# Altium project C210 Rev_D.PrjPcb (part 4 of 5)

## Sheet C210_0001_Serial_Interface.SchDoc: C210_0001_Serial_Interface
size B; Date: 2/26/2021; CompanyName: U-blox; DrawnBy: EMOO; Engineer: EMOO; Organization: U-blox; Address1: 2601 25th St. SE; Address2: Salem, OR 97302; SheetNumber: 1; SheetTotal: 7; Website: www.u-blox.com; SheetSize: B; SheetTitle: C-210 Serial Interface
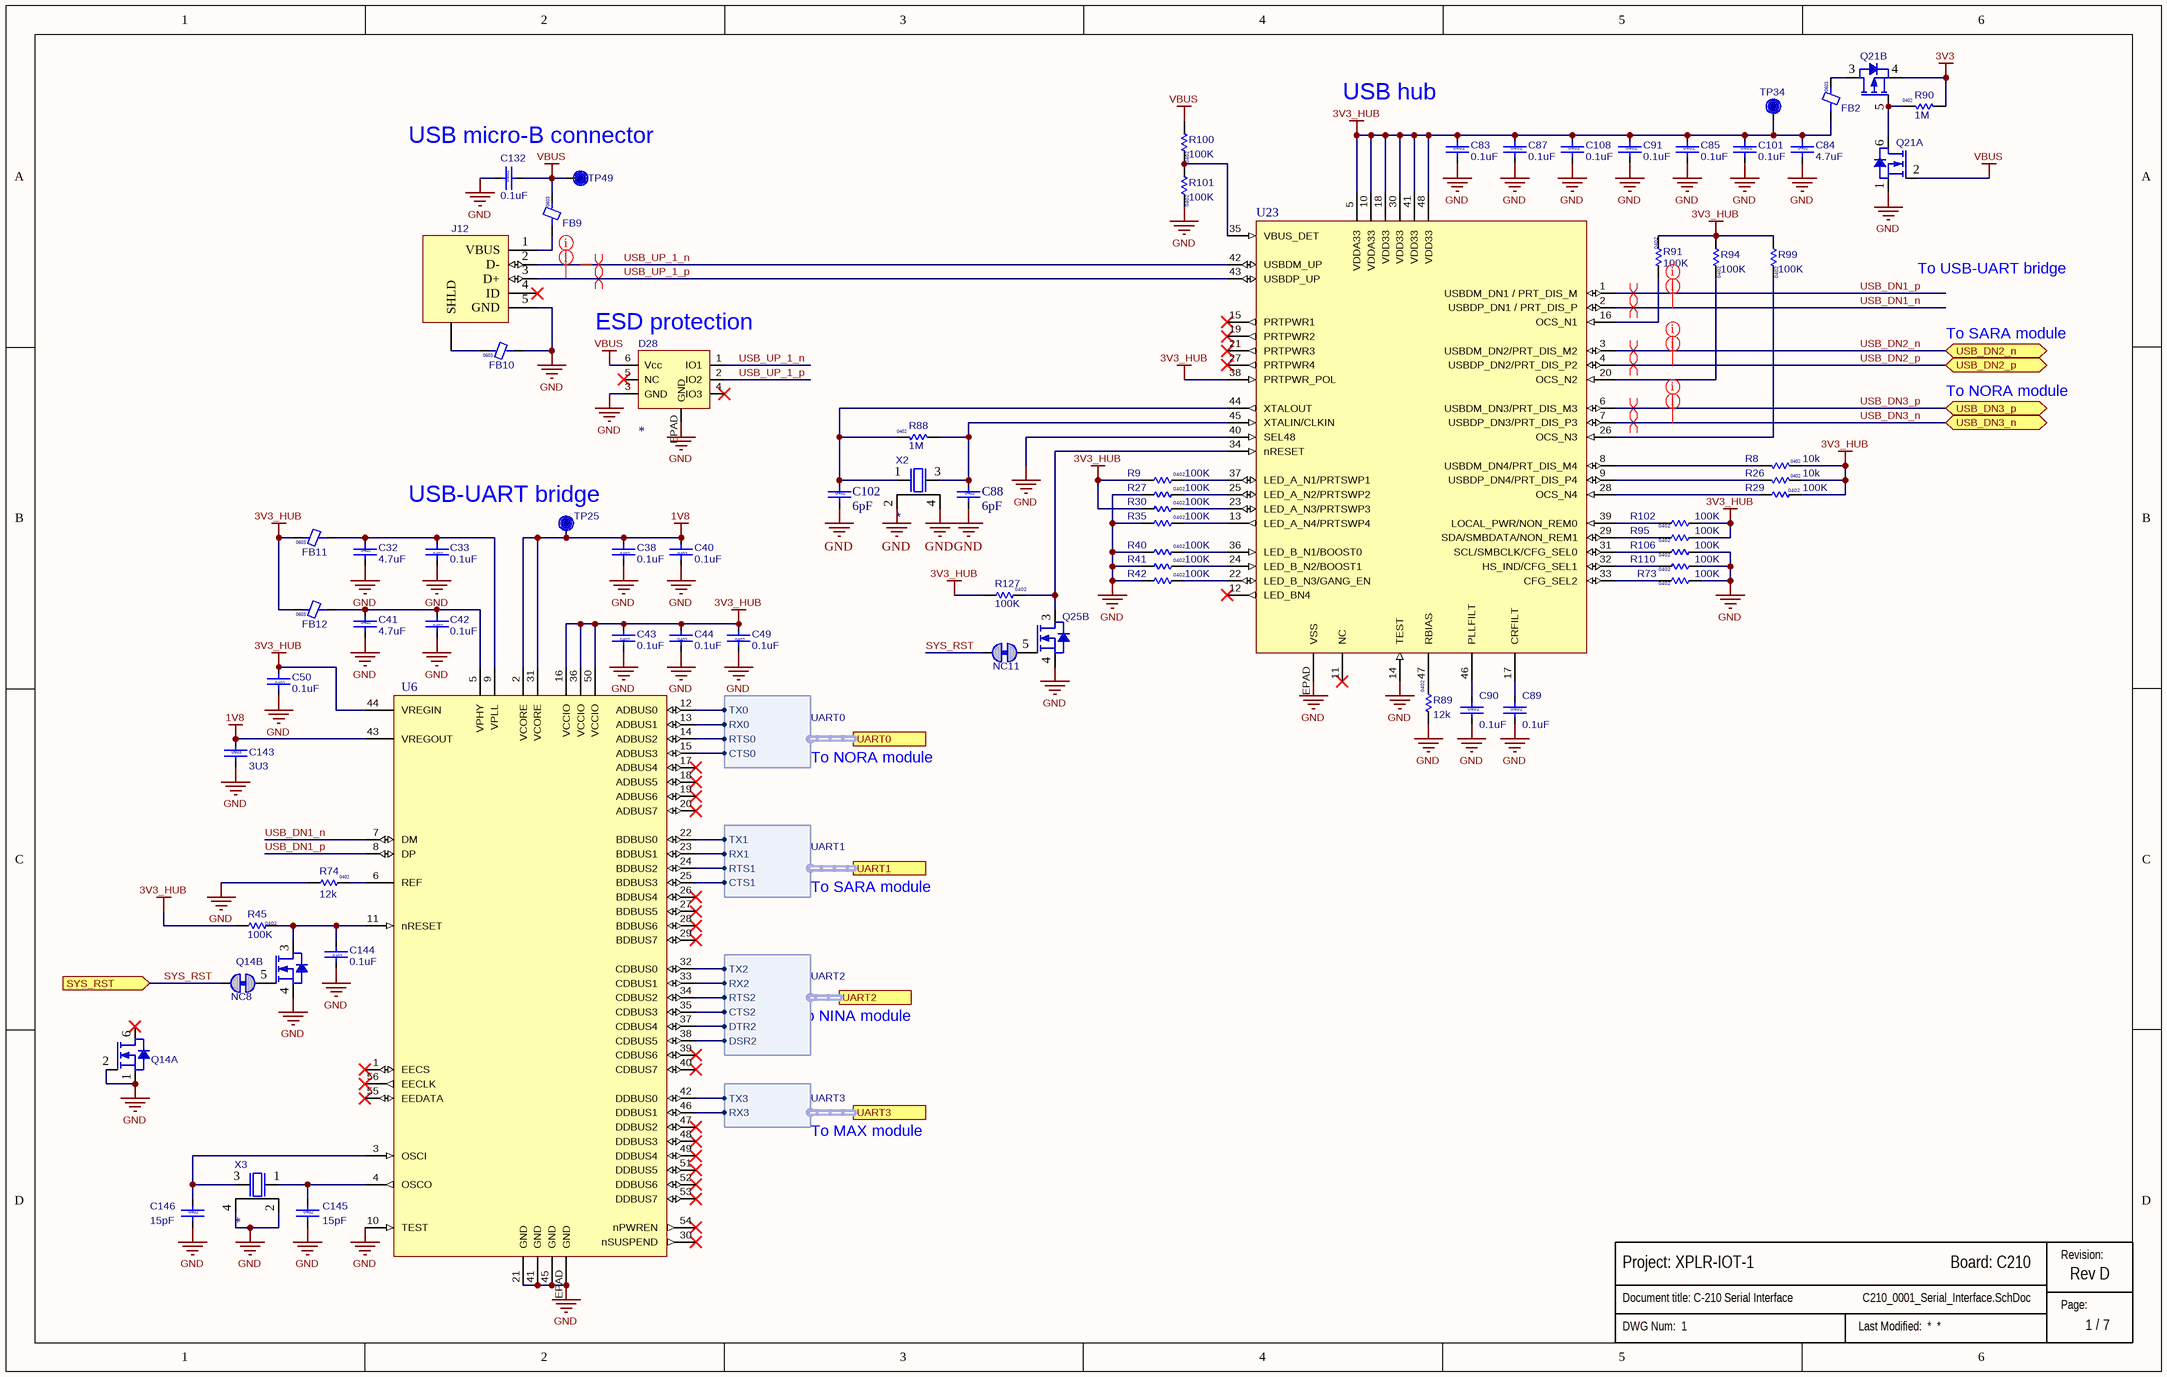
[diagram p5: C210_0001_Serial_Interface.SchDoc]

### Parts
(Parts that share a designator on the sheet are numbered #1, #2 ... from top to bottom, then left to right.)
?#7  (no value)  (graphical)
C32  value 4.7uF  Size: 0402  [Cap 0402 HD]
C33  value 0.1uF  Size: 0402  [Cap 0402 HD]  (hidden comment: 120-000160.1uF)
C38  value 0.1uF  Size: 0402  [Cap 0402 HD]  (hidden comment: 120-000160.1uF)
C40  value 0.1uF  Size: 0402  [Cap 0402 HD]  (hidden comment: 120-000160.1uF)
C41  value 4.7uF  Size: 0402  [Cap 0402 HD]
C42  value 0.1uF  Size: 0402  [Cap 0402 HD]  (hidden comment: 120-000160.1uF)
C43  value 0.1uF  Size: 0402  [Cap 0402 HD]  (hidden comment: 120-000160.1uF)
C44  value 0.1uF  Size: 0402  [Cap 0402 HD]  (hidden comment: 120-000160.1uF)
C49  value 0.1uF  Size: 0402  [Cap 0402 HD]  (hidden comment: 120-000160.1uF)
C50  value 0.1uF  Size: 0402  [Cap 0402 HD]  (hidden comment: 120-000160.1uF)
C83  value 0.1uF  Size: 0402  [Cap 0402 HD]  (hidden comment: 120-000160.1uF)
C84  value 4.7uF  Size: 0402  [Cap 0402 HD]
C85  value 0.1uF  Size: 0402  [Cap 0402 HD]  (hidden comment: 120-000160.1uF)
C87  value 0.1uF  Size: 0402  [Cap 0402 HD]  (hidden comment: 120-000160.1uF)
C88  value 6pF  Size: 0402  [Cap 0402 HD]
C89  value 0.1uF  Size: 0402  [Cap 0402 HD]  (hidden comment: 120-000160.1uF)
C90  value 0.1uF  Size: 0402  [Cap 0402 HD]  (hidden comment: 120-000160.1uF)
C91  value 0.1uF  Size: 0402  [Cap 0402 HD]  (hidden comment: 120-000160.1uF)
C101  value 0.1uF  Size: 0402  [Cap 0402 HD]  (hidden comment: 120-000160.1uF)
C102  value 6pF  Size: 0402  [Cap 0402 HD]
C108  value 0.1uF  Size: 0402  [Cap 0402 HD]  (hidden comment: 120-000160.1uF)
C132  value 0.1uF  Size: 0402  [Cap 0402 HD]  (hidden comment: 120-000160.1uF)
C143  value 3U3  Size: 0603  [Cap 0603 HD]
C144  value 0.1uF  Size: 0402  [Cap 0402 HD]  (hidden comment: 120-000160.1uF)
C145  value 15pF  Size: 0402  [Cap 0402 HD]
C146  value 15pF  Size: 0402  [Cap 0402 HD]
D28  (no value)  [TPD3E001DRSR]
FB2  Size: 0603  [BLM18EG221SN1]
FB9  Size: 0603  [BLM18EG221SN1]
FB10  Size: 0603  [BLM18EG221SN1]
FB11  Size: 0603  [BLM18EG221SN1]
FB12  Size: 0603  [BLM18EG221SN1]
J12  (no value)  [USB_Micro_RA_W-2TABS]
NC8  Solderbridge-ShortDNP  [Solderbridge-Short]  (value not drawn)  (net tie, no BOM)
NC11  Solderbridge-ShortDNP  [Solderbridge-Short]  (value not drawn)  (net tie, no BOM)
Q14  (no value)  [SOT-563]  (parts A,B of 2)
Q21  (no value)  [SOT-563]  (parts A,B of 2)
Q25  (no value)  [SOT-563]  (part B of 2)
R8  value 10k  Size: 0402  [RES 0402 HD]
R9  value 100K  Size: 0402  [RES 0402 HD]
R26  value 10k  Size: 0402  [RES 0402 HD]
R27  value 100K  Size: 0402  [RES 0402 HD]
R29  value 100K  Size: 0402  [RES 0402 HD]
R30  value 100K  Size: 0402  [RES 0402 HD]
R35  value 100K  Size: 0402  [RES 0402 HD]
R40  value 100K  Size: 0402  [RES 0402 HD]
R41  value 100K  Size: 0402  [RES 0402 HD]
R42  value 100K  Size: 0402  [RES 0402 HD]
R45  value 100K  Size: 0402  [RES 0402 HD]
R73  value 100K  Size: 0402  [RES 0402 HD]
R74  value 12k  Size: 0402  [RES 0402 HD]
R88  value 1M  Size: 0402  [RES 0402 HD]
R89  value 12k  Size: 0402  [RES 0402 HD]
R90  value 1M  Size: 0402  [RES 0402 HD]
R91  value 100K  Size: 0402  [RES 0402 HD]
R94  value 100K  Size: 0402  [RES 0402 HD]
R95  value 100K  Size: 0402  [RES 0402 HD]
R99  value 100K  Size: 0402  [RES 0402 HD]
R100  value 100K  Size: 0402  [RES 0402 HD]
R101  value 100K  Size: 0402  [RES 0402 HD]
R102  value 100K  Size: 0402  [RES 0402 HD]
R106  value 100K  Size: 0402  [RES 0402 HD]
R110  value 100K  Size: 0402  [RES 0402 HD]
R127  value 100K  Size: 0402  [RES 0402 HD]
TP25  TP  [TP12R]  (value not drawn)  (no BOM)
TP34  TP  [TP12R]  (value not drawn)  (no BOM)
TP49  TP  [TP12R]  (value not drawn)  (no BOM)
U6  (no value)  [QFN0.5P8.0x8.0-56Pin_EPAD]
U23  (no value)  [QFN0.5P7.0x7.0-48Pin_EPAD]
X2  (no value)  [XTAL_2520_HD]
X3  (no value)  [XTAL_2520]

### Ports
SYS_RST (in), UART0 (harness UART0), UART1 (harness UART1), UART2 (harness UART2), UART3 (harness UART3), USB_DN2_n (bidir), USB_DN2_p (bidir), USB_DN3_n (bidir), USB_DN3_p (bidir)

### Harnesses
UART0: TX0, RX0, RTS0, CTS0
UART1: TX1, RX1, RTS1, CTS1
UART2: TX2, RX2, RTS2, CTS2, DTR2, DSR2
UART3: TX3, RX3

### Nets
1V8: C38.2 C40.2 C143.1 TP25.1 U6.2(VCORE) U6.31(VCORE) U6.43(VREGOUT)
3V3: Q21.4(S2) R90.1
3V3_HUB: C43.2 C44.2 C49.2 C50.2 C83.1 C84.1 C85.1 C87.1 C91.1 C101.1 C108.1 FB2.1 FB11.2 FB12.2 R8.2 R9.1 R26.2 R29.2 R30.1 R45.1 R91.2 R94.1 R95.1 R99.1 R102.1 R127.1 TP34.1 U6.16(VCCIO) U6.36(VCCIO) U6.44(VREGIN) U6.50(VCCIO) U23.5(VDDA33) U23.10(VDDA33) U23.18(VDD33) U23.30(VDD33) U23.38(PRTPWR_POL) U23.41(VDD33) U23.48(VDD33)
GND: C32.2 C33.1 C38.1 C40.1 C41.2 C42.1 C43.1 C44.1 C49.1 C50.1 C83.2 C84.2 C85.2 C87.2 C88.2 C89.2 C90.2 C91.2 C101.2 C102.2 C108.2 C132.1 C143.2 C144.1 C145.2 C146.2 D28.3(GND) D28.EPAD(GND) FB10.1 J12.5(GND) Q14.1(S1) Q14.2(G1) Q14.4(S2) Q21.1(S1) Q25.4(S2) R27.1 R35.1 R40.1 R41.1 R42.1 R73.2 R74.1 R89.1 R101.2 R106.2 R110.2 U6.10(TEST) U6.21(GND) U6.41(GND) U6.45(GND) U6.EPAD(GND) U23.14(TEST) U23.40(SEL48) U23.EPAD(VSS) X2.2 X2.4 X3.2 X3.4
VBUS: C132.2 D28.6(Vcc) FB9.2 Q21.2(G1) R100.1 TP49.1
DSR2: U6.38(CDBUS5) ; port UART2.DSR2
DTR2: U6.37(CDBUS4) ; port UART2.DTR2
RX1/SARA_PRI_TX: U6.23(BDBUS1) ; port UART1.RX1
SYS_RST: NC8.2 NC11.2 ; port SYS_RST
TX1/SARA_PRI_RX: U6.22(BDBUS0) ; port UART1.TX1
USB_DN1_n: U6.7(DM) U23.2(USBDP_DN1_/_PRT_DIS_P)
USB_DN1_p: U6.8(DP) U23.1(USBDM_DN1_/_PRT_DIS_M)
USB_DN2_n: U23.3(USBDM_DN2/PRT_DIS_M2) ; port USB_DN2_n
USB_DN2_p: U23.4(USBDP_DN2/PRT_DIS_P2) ; port USB_DN2_p
USB_DN3_n: U23.7(USBDP_DN3/PRT_DIS_P3) ; port USB_DN3_n
USB_DN3_p: U23.6(USBDM_DN3/PRT_DIS_M3) ; port USB_DN3_p
USB_UP_1_n: D28.1(IO1) J12.2(D-) U23.42(USBDM_UP)
USB_UP_1_p: D28.2(IO2) J12.3(D+) U23.43(USBDP_UP)
NetC32_1: C32.1 C33.2 FB11.1 U6.9(VPLL)
NetC41_1: C41.1 C42.2 FB12.1 U6.5(VPHY)
NetC88_1: C88.1 R88.1 U23.45(XTALIN/CLKIN) X2.3
NetC89_1: C89.1 U23.17(CRFILT)
NetC90_1: C90.1 U23.46(PLLFILT)
NetC102_1: C102.1 R88.2 U23.44(XTALOUT) X2.1
NetC144_2: C144.2 Q14.3(D2) R45.2 U6.11(nRESET)
NetC145_1: C145.1 U6.4(OSCO) X3.1
NetC146_1: C146.1 U6.3(OSCI) X3.3
NetFB2_2: FB2.2 Q21.3(D2)
NetFB9_1: FB9.1 J12.1(VBUS)
NetFB10_2: FB10.2 J12.6(SHLD)
NetNC8_1: NC8.1 Q14.5(G2)
NetNC11_1: NC11.1 Q25.5(G2)
NetQ21_5: Q21.5(G2) Q21.6(D1) R90.2
NetQ25_3: Q25.3(D2) R127.2 U23.34(nRESET)
NetR8_1: R8.1 U23.8(USBDM_DN4/PRT_DIS_M4)
NetR9_2: R9.2 U23.37(LED_A_N1/PRTSWP1)
NetR26_1: R26.1 U23.9(USBDP_DN4/PRT_DIS_P4)
NetR27_2: R27.2 U23.25(LED_A_N2/PRTSWP2)
NetR29_1: R29.1 U23.28(OCS_N4)
NetR30_2: R30.2 U23.23(LED_A_N3/PRTSWP3)
NetR35_2: R35.2 U23.13(LED_A_N4/PRTSWP4)
NetR40_2: R40.2 U23.36(LED_B_N1/BOOST0)
NetR41_2: R41.2 U23.24(LED_B_N2/BOOST1)
NetR42_2: R42.2 U23.22(LED_B_N3/GANG_EN)
NetR69_2: U6.46(DDBUS1) ; port UART3.RX3
NetR73_1: R73.1 U23.33(CFG_SEL2)
NetR74_2: R74.2 U6.6(REF)
NetR89_2: R89.2 U23.47(RBIAS)
NetR91_1: R91.1 U23.16(OCS_N1)
NetR94_2: R94.2 U23.20(OCS_N2)
NetR95_2: R95.2 U23.29(SDA/SMBDATA/NON_REM1)
NetR99_2: R99.2 U23.26(OCS_N3)
NetR100_2: R100.2 R101.1 U23.35(VBUS_DET)
NetR102_2: R102.2 U23.39(LOCAL_PWR/NON_REM0)
NetR106_1: R106.1 U23.31(SCL/SMBCLK/CFG_SEL0)
NetR110_1: R110.1 U23.32(HS_IND/CFG_SEL1)
NetTP20_1: U6.25(BDBUS3) ; port UART1.CTS1
NetTP21_1: U6.24(BDBUS2) ; port UART1.RTS1
NetU6_12: U6.12(ADBUS0) ; port UART0.TX0
NetU6_13: U6.13(ADBUS1) ; port UART0.RX0
NetU6_14: U6.14(ADBUS2) ; port UART0.RTS0
NetU6_15: U6.15(ADBUS3) ; port UART0.CTS0
NetU6_32: U6.32(CDBUS0) ; port UART2.TX2
NetU6_33: U6.33(CDBUS1) ; port UART2.RX2
NetU6_34: U6.34(CDBUS2) ; port UART2.RTS2
NetU6_35: U6.35(CDBUS3) ; port UART2.CTS2
NetU6_42: U6.42(DDBUS0) ; port UART3.TX3

Not connected (* = marked no-connect by the designer): D28 4(IO3)* 5(NC)*; J12 4(ID)*; Q14 6(D1)*; U6 1(EECS)* 17(ADBUS4)* 18(ADBUS5)* 19(ADBUS6)* 20(ADBUS7)* 26(BDBUS4)* 27(BDBUS5)* 28(BDBUS6)* 29(BDBUS7)* 30(nSUSPEND)* 39(CDBUS6)* 40(CDBUS7)* 47(DDBUS2)* 48(DDBUS3)* 49(DDBUS4)* 51(DDBUS5)* 52(DDBUS6)* 53(DDBUS7)* 54(nPWREN)* 55(EEDATA)* 56(EECLK)*; U23 11(NC)* 12(LED_BN4)* 15(PRTPWR1)* 19(PRTPWR2)* 21(PRTPWR3)* 27(PRTPWR4)*

### Layout directives
differential pair; net class USB_DIFF: USB_DN1_n, USB_DN1_p, USB_DN2_n, USB_DN2_p, USB_DN3_n, USB_DN3_p, USB_UP_1_n, USB_UP_1_p
net class USB: USB_DN1_n, USB_DN1_p, USB_DN2_n, USB_DN2_p, USB_DN3_n, USB_DN3_p, USB_UP_1_n, USB_UP_1_p

### Notes on the sheet
- (near C83) USB hub
- USB micro-B connector
- To USB-UART bridge
- (near D28) ESD protection
- To NORA module
- To SARA module
- (near TP25) USB-UART bridge
- To NINA module
- To MAX module
- Revision:
- Page:

### Library data of the parts
?#7 = Sub_Title_Block: as ?#5 on sheet C210_0006_Power
C32 C41 C84 = 120-00020: as C47 on sheet C210_0006_Power; Part Number: 120-00020; Supplier 1: Digi-Key; Supplier Part Number 1: 1276-1482-1-ND; Manufacturer 2: Yageo; Manufacturer Part Number 2: CC0402KRX5R6BB475; Supplier 2: Digi-Key; Supplier Part Number 2: 311-3477-1-ND; Height: 0.55mm; Max Operating Temp: 85; Min Operating Temp: -55; Pins: 2; Revision: 0C; Temperature Coefficient: X5R; Voltage: 10V
C33 C38 C40 C42-C44 C49 C50 C83 C85 C87 C89-C91 C101 C108 C132 C144 = 120-00016: as C45 on sheet C210_0006_Power; Part Number: 120-00016; Revision: 0A; Supplier 1: Digi-Key; Supplier Part Number 1: 490-6297-1-ND; Manufacturer 2: Yageo; Manufacturer P/N 2: CC0402KRX5R6BB104; Supplier 2: Digi-Key; Supplier Part Number 2: 311-1336-1-ND; Arena Link: https://app.bom.com/a/GYHPV2L2L43KRMBK?v=spec.summary; Height: 0.55mm; Pins: 2; Temperature Coefficient: X5R; Voltage: 10V
C88 C102 = 120-00048: Cap, Ceramic 6pF 50V NP0 0402  Tolerance = +/-0.5pF; Manufacturer 1: Cal-Chip Electronics; Manufacturer Part Number 1: GMC04CG6R0D50NT; Part Name: CAP CER 6pF 50V +/-0.5pF NP0 0402; Item Phase: In Production; Tolerance: Other; Use in new designs: Yes; UBX Code: None; Part Number: 120-00048; Supplier 1: None; Supplier Part Number 1: None; Manufacturer 2: Darfon Electronics Corp; Manufacturer Part Number 2: C1005NPO609DGTS; Supplier 2: None; Supplier Part Number 2: None; Height: 0.55mm; Max Operating Temp: 125; Min Operating Temp: -55; Pins: 2; Revision: 0B; Temperature Coefficient: NP0; Voltage: 50V
C143 = UBXH01-0000035: CAP CER X5R 0603 3U3 10% 10V; Manufacturer: Murata Manufacturing Company, Ltd.; Manufacturer P/N: GRM188R61A335KE15; Editor: dario.antonaz; Released by: karel.cotic; Env: ROHS; Permitted Use: Volume Products; Perferred: PREF; Mfg P/N Status: NRND; Mfg P/N Split: 100; Mfg P/N Released: Yes; Part Number: UBXH01-0000035; Tolerance: 10%; Max Voltage: 10V; Part Type: Capacitor; Release Data: 2011-07-12T16:43:12; UBX Wiki: https://wiki.u-blox.com/bin/view/Operations/PartDetails?index=15220; RefDes: C; Mfg P/N Datasheet: https://wiki.u-blox.com/bin/view/Generic/Docs/DocumentSummary?index=15218; Manufacturer 2: Samsung Electro-Mechanics; Manufacturer P/N 2: CL10A335KP8NNN; Mfg P/N Status 2: Active; Mfg P/N Split 2: 0; Mfg P/N Released 2: Yes; Mfg P/N Datasheet 2: https://wiki.u-blox.com/bin/view/Generic/Docs/DocumentSummary?index=28127
C145 C146 = 120-00110: Capacitor, Ceramic, 15pF 5%, 50V, NPO, 0402; Manufacturer 1: Murata Electronics North America; Manufacturer Part Number 1: GRM1555C1H150JA01D; Part Name: CAP CER 15pF 50V 5% NP0 0402; Item Phase: In Production; Temperature Coefficient: NP0; Tolerance: +/- 5%; Use in new designs: Yes; UBX Code: None; Part Number: 120-00110; Supplier 1: Digi-Key; Supplier Part Number 1: 490-5888-1-ND; Manufacturer 2: None; Manufacturer Part Number 2: None; Supplier 2: None; Supplier Part Number 2: None; Height: 0.55mm; Max Operating Temp: 125; Min Operating Temp: -55; Pins: 2; Revision: 0A; Voltage: 50V
D28 = TPD3E001: as D20 on sheet C210_0007_Sensors; Manufacturer Part Number 1: TPD3E001DRSR; Manufacturer 2: None; Manufacturer Part Number 2: None; Supplier 2: None; Supplier Part Number 2: None; Body Size: 3mm x 3mm; Height: 0.80mm; Max Operating Temp: 85; Min Operating Temp: -40; Pins: 6; Revision: 0A; UBX Code: None; Manufacturer P/N: *
FB2 FB9-FB12 = BLM18EG221SN1: Ferrite Bead, 220ohm @ 100MHz, 2A, 0603; Manufacturer 1: Murata Electronics North America; Manufacturer Part Number 1: BLM18EG221SN1D; Part Name: Ferrite Bead 220ohm 2A 0503; Body Size: None; Item Phase: Unreleased; Use in new designs: Yes; Value: None; Part Number: BLM18EG221SN1; Supplier 1: Digi-Key; Supplier Part Number 1: 490-3992-2-ND; Current: 2A; Height: 0.8mm; MFG Package: None; Max Operating Temp: 85; Min Operating Temp: -55; Pins: None; Revision: None; Voltage: None; Manufacturer 2: None; Manufacturer Part Number 2: None; Supplier 2: None; Supplier Part Number 2: None; UBX Code: None
J12 = 130-00008: USB Micro B Receptacle, Right Angle SMT with 2 TH Tabs, 0.65mm; Part Name: CON USB Micro-B SMT RA 2 Tabs; Part_Type: Connector; Manufacturer: FCI; Manufacturer P/N: 10118193-0001LF; Item_Phase: Production; Keyed: Yes; Locking: No; Rows: 1; Part Number: 130-00008; Revision: 0B; Supplier 1: Digi-Key; Supplier Part Number 1: 609-4616-1-ND; Manufacturer 2: Seeed Technology; Manufacturer P/N 2: Rigado 130-00008; Supplier 2: Seeed Technology; Supplier Part Number 2: Rigado 130-00008; Arena Link: https://app.bom.com/a/O6PX3ATATCBTBM9U?v=spec.summary; Color: Silver; Component Mounting Type: SMT; Connector Type: USB; Height: 3.10mm; Length: 5.05mm; Pin Pitch: 0.65mm; Pins: 5; Use in new designs: Yes; Width: 7.86mm
NC8 NC11 = Solderbridge-Short: Added By: Paul B; Part Number: Solderbridge-Short; Height: 0; DNP: DNP; Added Date: 12/2/2015
Q14 Q25 = 140-00016: MOSFET 2N-CH 20V 0.8A, SOT-563; Manufacturer 1: Toshiba Semiconductor and Storage; Manufacturer Part Number 1: SSM6N56FE,LM; Part Name: MOSFET 2N-CH 20V 0.8A SOT-563; Body Size: 1.6mm x 1.2mm; Current: 800mA; Item Phase: In Production; Transistor Type: N-Channel; Thermal Pad: No; Use in new designs: Yes; UBX Code: None; Part Number: 140-00016; Supplier 1: Digi-Key; Supplier Part Number 1: SSM6N56FELMCT-ND; Height: 0.6mm; MFG Package: SOT-563; Max Operating Temp: 150; Min Operating Temp: -55; Pins: 6; Revision: 0A; Voltage: 20V; Manufacturer 2: None; Manufacturer Part Number 2: None; Supplier 2: None; Supplier Part Number 2: None
Q21 = 140-00030: MOSFET N/P-CH 20V SOT-563, 540 mA, −430 mA; Manufacturer 1: ON Semiconductor; Manufacturer Part Number 1: NTZD3155CT2G; Body Size: 1.6mmx1.6mm; Item Phase: In Production; Transistor Type: Multiple; Thermal Pad: No; Use in new designs: Yes; UBX Code: None; Part Number: 140-00030; Supplier 1: Digi-Key; Supplier Part Number 1: NTZD3155CT2GOSCT-ND; Current: 540 mA, −430 mA; Height: 0.6mm; MFG Package: SOT-563; Max Operating Temp: 150; Min Operating Temp: -55; Part Name: MOSFET N/P-CH 20V SOT-563; Pins: 6; Revision: 0A; Voltage: 20V; Manufacturer 2: None; Manufacturer Part Number 2: None; Supplier 2: None; Supplier Part Number 2: None
R8 R26 = 180-00024: as R36 on sheet C210_0006_Power; Part Number: 180-00024; Supplier 1: Digi-Key; Supplier Part Number 1: 1276-3431-1-ND; Manufacturer 2: Hong Kong Resistors Manufactory; Manufacturer Part Number 2: RCT0210KFLF; Supplier 2: None; Supplier Part Number 2: None; Height: 0.4mm; Max Operating Temp: 155; Min Operating Temp: -55; Pins: 2; Power: 1/16W; Revision: 0E; Voltage: N/A
R9 R27 R29 R30 R35 R40-R42 R45 R73 R91 R94 R95 R99-R102 R106 R110 R127 = 180-00093: as R50 on sheet C210_0006_Power; Part Number: 180-00093; Supplier 1: Digi-Key; Supplier Part Number 1: 311-100KLRCT-ND; Manufacturer 2: Rohm Semiconductor; Manufacturer Part Number 2: MCR01MRTF1003; Supplier 2: Digi-Key; Supplier Part Number 2: RHM100KCDCT-ND; Height: 0.4mm; Max Operating Temp: 155; Min Operating Temp: -55; Pins: 2; Power: 1/16W; Revision: 0B; UBX Code: None
R74 R89 = 180-00096: Resistor 12k ohm 1% 1/16W 0402; Manufacturer 1: None; Part Name: RES SMD 12K OHM 1% 1/16W 0402; Item Phase: In Production; Tolerance: +/- 1%; Use in new designs: Yes; Part Number: 180-00096; Manufacturer Part Number 1: None; Supplier 1: Digi-Key; Supplier Part Number 1: 1276-4122-1-ND; Manufacturer 2: Yageo; Manufacturer Part Number 2: RC0402FR-0712KL; Supplier 2: Digi-Key; Supplier Part Number 2: 311-12.0KLRCT-ND; Height: 0.4mm; Max Operating Temp: 155; Min Operating Temp: -55; Pins: 2; Power: 1/16W; Revision: 0A; Voltage: None; UBX Code: None
R88 R90 = 180-00054: as R43 on sheet C210_0006_Power; Part Number: 180-00054; Supplier 1: Digi-Key; Supplier Part Number 1: 1276-3433-1-ND; Manufacturer 2: Hong Kong Resistors Manufactory; Manufacturer Part Number 2: RCT021MFLF; Supplier 2: None; Supplier Part Number 2: None; Height: 0.4mm; Max Operating Temp: 155; Min Operating Temp: -55; Pins: 2; Power: 1/16W; Revision: 0D; UBX Code: None
TP25 TP34 TP49 = TP_R: as TP28-TP31 on sheet C210_0006_Power; Size: 1.0mm; Height: 0; DNP: DNP; Added Date: 2/1/2015; Checked By: Paul B; Checked Date: 2/5/2015
U6 = FT4232H: IC, SMT, UART/SERIAL BRIDGE, QUAD, USB 2.0, FULL HANDSHAKE, 12MBps, 2.97-3.63V, 8mmx8mm QFN56; Manufacturer 1: FTDI; Body Size: 8.0mm x 8.0mm; Item Phase: Unreleased; MFG Package: QFN-56; SMT Pitch: 0.5mm; Use in new designs: Yes; UBX Code: None; Manufacturer Part Number 1: FT4232H; Height: 0.9mm; Max Operating Temp: 85; Min Operating Temp: -40; Pins: 56; Revision: None; Size: Other; Voltage: 2.97-3.63V; Manufacturer 2: None; Manufacturer Part Number 2: None; Supplier 2: None; Supplier Part Number 2: None
U23 = USB2514-HZH: 4-PORT USB 2.0 HUB CTRLR, QFN-48, 7.0mmx7.0mm; Manufacturer 1: SMSC; Current: None; Item Phase: In Production; Use in new designs: Yes; Part Number: USB2514-HZH; Manufacturer Part Number 1: USB2514-HZH; Body Size: 7.0mm x 7.0mm; Height: 1.0mm; MFG Package: QFN-48; Max Operating Temp: 70; Min Operating Temp: 0; Part Name: USB2514-HZH; Pins: 48; Revision: 0A; Voltage: N/A; UBX Code: None
X2 = 100-00017: Crystal, 24.0000MHz, 20ppm, 10pF, 100 Ohm, -20Â°C - 70Â°C, SMT 4 Pin 2520; Manufacturer 1: Abracon LLC; Manufacturer Part Number 1: ABM10-24.000MHZ-E20-T; Part Name: XTAL 24MHz 10pF 20ppm 2520; Body Size: 2.5mm x 2.0mm; Item Phase: Unreleased; MFG Package: 2520; Use in new designs: Yes; Voltage: None; Value: *; Part Number: 100-00017; Supplier 1: Digi-Key; Supplier Part Number 1: 535-9093-1-ND; Manufacturer 2: Raltron Electronics; Manufacturer Part Number 2: R2520-24.000-10-1010-TR-NS4; Supplier 2: None; Supplier Part Number 2: None; Height: 0.7mm; Max Operating Temp: 70; Min Operating Temp: -20; Pins: 4; Revision: None; UBX Code: None
X3 = 100-00033: 12MHz ±10ppm Crystal 8pF 125 Ohm -40°C ~ 85°C Surface Mount 4-SMD, No Lead; Manufacturer 1: Abracon LLC; Manufacturer Part Number 1: ABM10-167-12.000MHZ-T3; Part Name: XTAL 12MHz, 8pF, 30ppm; Body Size: 2.5mm X 2.0mm; Item Phase: Unreleased; Use in new designs: Yes; Voltage: None; Value: *; Part Number: 100-00033; Supplier 1: Digi-Key; Supplier Part Number 1: 535-13521-1-ND; Manufacturer 2: None; Manufacturer Part Number 2: None; Supplier 2: None; Supplier Part Number 2: None; Height: 0.7mm; MFG Package: 4-SMD; Max Operating Temp: 85; Min Operating Temp: -40; Pins: 4; Revision: None; UBX Code: None

## Sheet C210_0004_MAX_Module.SchDoc: C210_0004_MAX_Module
size B; Date: 2/26/2021; CompanyName: U-blox; DrawnBy: EMOO; Engineer: EMOO; Organization: U-blox; Address1: 2601 25th St. SE; Address2: Salem, OR 97302; SheetNumber: 4; SheetTotal: 7; Website: www.u-blox.com; SheetSize: B; SheetTitle: C-210 MAX Module
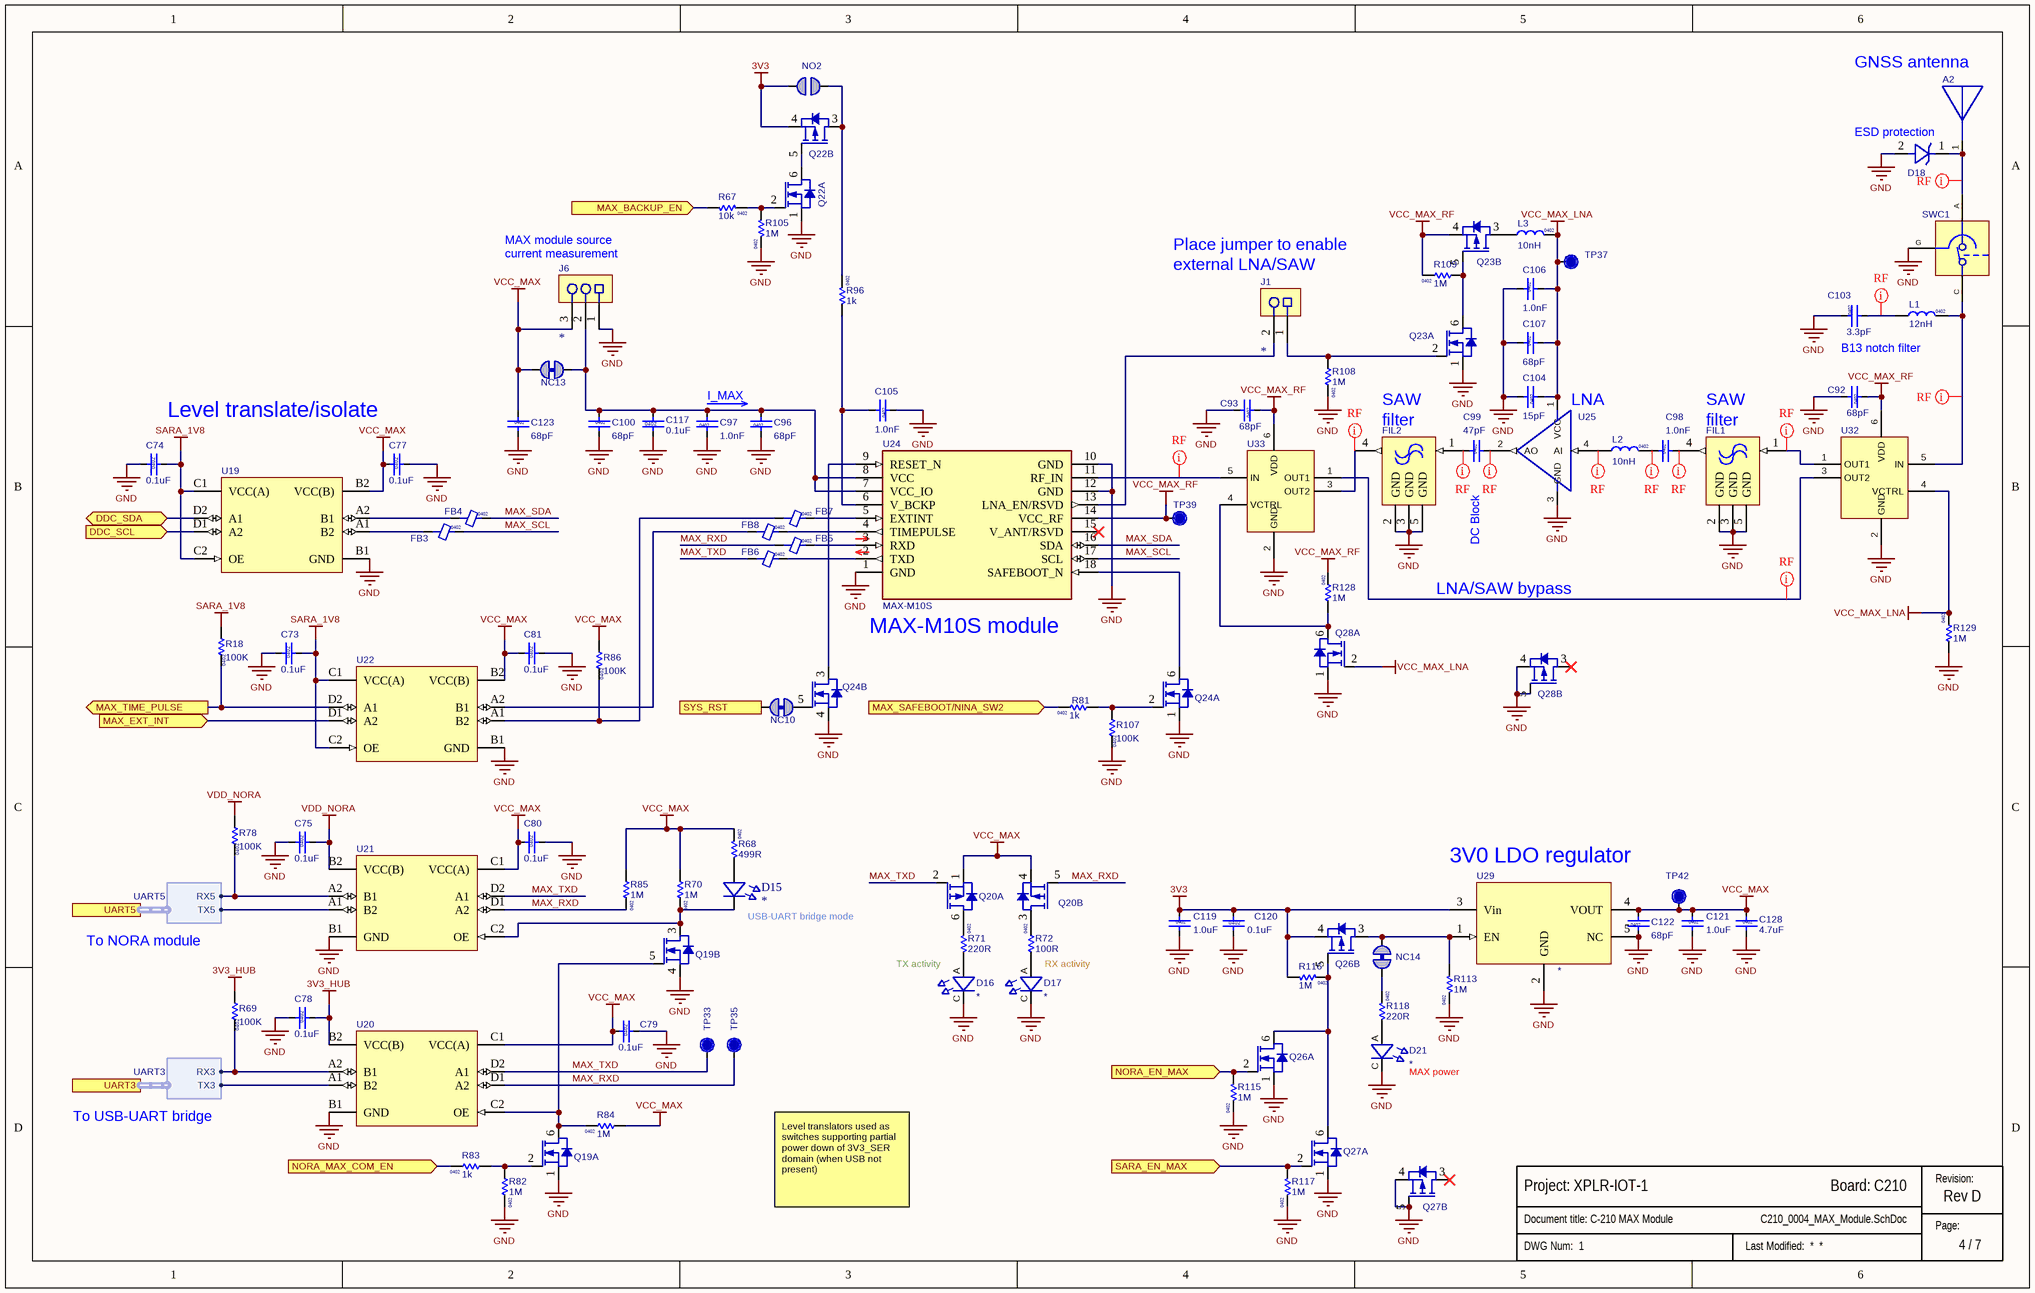
[diagram p6: C210_0004_MAX_Module.SchDoc]

### Parts
(Parts that share a designator on the sheet are numbered #1, #2 ... from top to bottom, then left to right.)
?#8  (no value)  (graphical)
A2  CGGP.25.4.E.02  [CGGP.25.4.E.02]  (value not drawn)
C73  value 0.1uF  Size: 0402  [Cap 0402 HD]  (hidden comment: 120-000160.1uF)
C74  value 0.1uF  Size: 0402  [Cap 0402 HD]  (hidden comment: 120-000160.1uF)
C75  value 0.1uF  Size: 0402  [Cap 0402 HD]  (hidden comment: 120-000160.1uF)
C77  value 0.1uF  Size: 0402  [Cap 0402 HD]  (hidden comment: 120-000160.1uF)
C78  value 0.1uF  Size: 0402  [Cap 0402 HD]  (hidden comment: 120-000160.1uF)
C79  value 0.1uF  Size: 0402  [Cap 0402 HD]  (hidden comment: 120-000160.1uF)
C80  value 0.1uF  Size: 0402  [Cap 0402 HD]  (hidden comment: 120-000160.1uF)
C81  value 0.1uF  Size: 0402  [Cap 0402 HD]  (hidden comment: 120-000160.1uF)
C92  value 68pF  Size: 0402  [Cap 0402 HD]
C93  value 68pF  Size: 0402  [Cap 0402 HD]
C96  value 68pF  Size: 0402  [Cap 0402 HD]
C97  value 1.0nF  Size: 0402  [Cap 0402 HD]
C98  value 1.0nF  Size: 0402  [Cap 0402 HD]
C99  value 47pF  Size: 0402  [Cap 0402 HD]
C100  value 68pF  Size: 0402  [Cap 0402 HD]
C103  value 3.3pF  Size: 0402  [Cap 0402 HD]
C104  value 15pF  Size: 0402  [Cap 0402 HD]
C105  value 1.0nF  Size: 0402  [Cap 0402 HD]
C106  value 1.0nF  Size: 0402  [Cap 0402 HD]
C107  value 68pF  Size: 0402  [Cap 0402 HD]
C117  value 0.1uF  Size: 0402  [Cap 0402 HD]  (hidden comment: 120-000160.1uF)
C119  value 1.0uF  Size: 0402  [Cap 0402 HD]  (hidden comment: 120-000171.0uF)
C120  value 0.1uF  Size: 0402  [Cap 0402 HD]  (hidden comment: 120-000160.1uF)
C121  value 1.0uF  Size: 0402  [Cap 0402 HD]  (hidden comment: 120-000171.0uF)
C122  value 68pF  Size: 0402  [Cap 0402 HD]
C123  value 68pF  Size: 0402  [Cap 0402 HD]
C128  value 4.7uF  Size: 0402  [Cap 0402 HD]
D15  (no value)  [LED-0603]
D16  (no value)  [LTST-C190KGKT]
D17  (no value)  [LTST-C190YKT]
D18  (no value)  [SOD-923_2]
D21  (no value)  [LTST-C190EKT]
FB3  Size: 0402  [IND 0402]
FB4  Size: 0402  [IND 0402]
FB5  Size: 0402  [IND 0402]
FB6  Size: 0402  [IND 0402]
FB7  Size: 0402  [IND 0402]
FB8  Size: 0402  [IND 0402]
FIL1  (no value)  [QCS5P]
FIL2  (no value)  [QCS5P]
J1  10129380-902001ALF  [HDR-0.1P-2Pin-1Row-SMT]  (value not drawn)
J6  (no value)  [HDR-0.1P-3Pin-1Row-SMT]
L1  value 12nH  Size: 0402  [IND 0402 HD]
L2  value 10nH  Size: 0402  [IND 0402]
L3  value 10nH  Size: 0402  [IND 0402]
NC10  Solderbridge-ShortDNP  [Solderbridge-Short]  (value not drawn)  (net tie, no BOM)
NC13  Solderbridge-ShortDNP  [Solderbridge-Short]  (value not drawn)  (net tie, no BOM)
NC14  Solderbridge-ShortDNP  [Solderbridge-Short]  (value not drawn)  (net tie, no BOM)
NO2  Solderbridge-OpenDNP  [Solderbridge-Open]  (value not drawn)  (no BOM)
Q19  (no value)  [SOT-563]  (parts A,B of 2)
Q20  (no value)  [FDY2000PZ]  (parts A,B of 2)
Q22  (no value)  [SOT-563]  (parts A,B of 2)
Q23  (no value)  [SOT-563]  (parts A,B of 2)
Q24  (no value)  [SOT-563]  (parts A,B of 2)
Q26  (no value)  [SOT-563]  (parts A,B of 2)
Q27  (no value)  [SOT-563]  (parts A,B of 2)
Q28  (no value)  [SOT-563]  (parts A,B of 2)
R18  value 100K  Size: 0402  [RES 0402 HD]
R67  value 10k  Size: 0402  [RES 0402 HD]
R68  value 499R  Size: 0402  [RES 0402 HD]
R69  value 100K  Size: 0402  [RES 0402 HD]
R70  value 1M  Size: 0402  [RES 0402 HD]
R71  value 220R  Size: 0402  [RES 0402 HD]
R72  value 100R  Size: 0402  [RES 0402 HD]
R78  value 100K  Size: 0402  [RES 0402 HD]
R81  value 1k  Size: 0402  [RES 0402 HD]
R82  value 1M  Size: 0402  [RES 0402 HD]
R83  value 1k  Size: 0402  [RES 0402 HD]
R84  value 1M  Size: 0402  [RES 0402 HD]
R85  value 1M  Size: 0402  [RES 0402 HD]
R86  value 100K  Size: 0402  [RES 0402 HD]
R96  value 1k  Size: 0402  [RES 0402 HD]
R105  value 1M  Size: 0402  [RES 0402 HD]
R107  value 100K  Size: 0402  [RES 0402 HD]
R108  value 1M  Size: 0402  [RES 0402 HD]
R109  value 1M  Size: 0402  [RES 0402 HD]
R113  value 1M  Size: 0402  [RES 0402 HD]
R115  value 1M  Size: 0402  [RES 0402 HD]
R116  value 1M  Size: 0402  [RES 0402 HD]
R117  value 1M  Size: 0402  [RES 0402 HD]
R118  value 220R  Size: 0402  [RES 0402 HD]
R128  value 1M  Size: 0402  [RES 0402 HD]
R129  value 1M  Size: 0402  [RES 0402 HD]
SWC1  (no value)  [MS-156C3]
TP33  TP  [TP12R]  (value not drawn)  (no BOM)
TP35  TP  [TP12R]  (value not drawn)  (no BOM)
TP37  TP  [TP12R]  (value not drawn)  (no BOM)
TP39  TP  [TP12R]  (value not drawn)  (no BOM)
TP42  TP  [TP12R]  (value not drawn)  (no BOM)
U19  (no value)  [TXS0102YZP]
U20  (no value)  [TXS0102YZP]
U21  (no value)  [TXS0102YZP]
U22  (no value)  [TXS0102YZP]
U24  MAX-M10S  [MAX-M8]
U25  (no value)  [BGA0.4P2x2-4Pin]
U29  (no value)  [SOT-553]
U32  (no value)  [SKY13585-679LF]
U33  (no value)  [SKY13585-679LF]

### Ports
DDC_SCL (in), DDC_SDA (bidir), MAX_BACKUP_EN (in), MAX_EXT_INT (in), MAX_SAFEBOOT/NINA_SW2 (in), MAX_TIME_PULSE (out), NORA_EN_MAX (in), NORA_MAX_COM_EN (in), SARA_EN_MAX (in), SYS_RST (in), UART3 (harness UART3), UART5 (harness UART5)

### Harnesses
UART3: TX3, RX3
UART5: TX5, RX5

### Nets
3V3: C119.1 C120.1 NO2.1 Q22.4(S2) Q26.4(S2) R116.1 U29.3(Vin)
3V3_HUB: C78.2 R69.1 U20.B2(VCC(B))
GND: C73.1 C74.1 C75.1 C77.2 C78.1 C79.2 C80.2 C81.2 C92.2 C93.2 C96.1 C97.1 C100.2 C103.1 C104.2 C105.1 C106.1 C107.1 C117.1 C119.2 C120.2 C121.2 C122.1 C123.2 C128.2 D16.C(Cathode) D17.C(Cathode) D18.2 D21.C(Cathode) FIL1.2(GND) FIL1.3(GND) FIL1.5(GND) FIL2.2(GND) FIL2.3(GND) FIL2.5(GND) J6.1 Q19.1(S1) Q19.4(S2) Q22.1(S1) Q23.1(S1) Q24.1(S1) Q24.4(S2) Q26.1(S1) Q27.1(S1) Q27.4(S2) Q27.5(G2) Q28.1(S1) Q28.4(S2) Q28.5(G2) R82.2 R105.2 R107.2 R108.2 R113.2 R115.2 R117.2 R129.1 SWC1.G U19.B1(GND) U20.B1(GND) U21.B1(GND) U22.B1(GND) U24.1(GND) U24.10(GND) U24.12(GND) U25.3(GND) U29.2(GND) U29.5(NC) U32.2(GND) U33.2(GND)
SARA_1V8: C73.2 C74.2 R18.1 U19.C1(VCC(A)) U19.C2(OE) U22.C1(VCC(A)) U22.C2(OE)
VCC_MAX: C77.1 C79.1 C80.1 C81.1 C121.1 C122.2 C123.1 C128.1 J6.3 NC13.2 Q20.1(S1) Q20.4(S2) R68.2 R70.1 R84.1 R85.1 R86.1 TP42.1 U19.B2(VCC(B)) U20.C1(VCC(A)) U21.C1(VCC(A)) U22.B2(VCC(B)) U29.4(VOUT)
VCC_MAX_LNA: C104.1 C106.2 C107.2 L3.2 Q28.2(G1) R129.2 TP37.1 U25.1(VCC) U32.4(VCTRL)
VCC_MAX_RF: C92.1 C93.1 Q23.4(S2) R109.2 R128.2 TP39.1 U24.14(VCC_RF) U32.6(VDD) U33.6(VDD)
VDD_NORA: C75.2 R78.1 U21.B2(VCC(B))
MAX_RXD: FB5.1 Q20.5(G2) R85.2 TP35.1 U20.D1(A2) U21.D1(A2)
MAX_SCL: FB3.2 U24.17(SCL)
MAX_SDA: FB4.2 U24.16(SDA)
MAX_TXD: FB6.1 Q20.2(G1) TP33.1 U20.D2(A1) U21.D2(A1)
RX5: R78.2 U21.A2(B1) ; port UART5.RX5
SYS_RST: NC10.2 ; port SYS_RST
TX5: U21.A1(B2) ; port UART5.TX5
NetA2_1: A2.1 D18.1 SWC1.A
NetC96_2: C96.2 C97.2 C100.1 C117.2 J6.2 NC13.1 U24.7(VCC_IO) U24.8(VCC)
NetC98_1: C98.1 L2.2
NetC98_2: C98.2 FIL1.4(Output)
NetC99_1: C99.1 FIL2.1(Input)
NetC99_2: C99.2 U25.2(AO)
NetC103_2: C103.2 L1.1
NetC105_2: C105.2 R96.1 U24.6(V_BCKP)
NetD15_1: D15.1(C) Q19.3(D2) R70.2 U21.C2(OE)
NetD15_2: D15.2(A) R68.1
NetD16_A: D16.A(Anode) R71.1
NetD17_A: D17.A(Anode) R72.1
NetD21_A: D21.A(Anode) R118.1
NetFB3_1: FB3.1 U19.A1(B2)
NetFB4_1: FB4.1 U19.A2(B1)
NetFB5_2: FB5.2 U24.3(RXD)
NetFB6_2: FB6.2 U24.2(TXD)
NetFB7_1: FB7.1 R86.2 U22.A1(B2)
NetFB7_2: FB7.2 U24.5(EXTINT)
NetFB8_1: FB8.1 U22.A2(B1)
NetFB8_2: FB8.2 U24.4(TIMEPULSE)
NetFIL1_1: FIL1.1(Input) U32.1(OUT1)
NetFIL2_4: FIL2.4(Output) U33.3(OUT2)
NetJ1_1: J1.1 Q23.2(G1) R108.1
NetJ1_2: J1.2 U24.13(LNA_EN/RSVD)
NetL1_2: L1.2 SWC1.C U32.5(IN)
NetL2_1: L2.1 U25.4(AI)
NetL3_1: L3.1 Q23.3(D2)
NetNC10_1: NC10.1 Q24.5(G2)
NetNC14_1: NC14.1 Q26.3(D2) R113.1 U29.1(EN)
NetNC14_2: NC14.2 R118.2
NetNO2_2: NO2.2 Q22.3(D2) R96.2
NetQ1_5: R81.2 ; port MAX_SAFEBOOT/NINA_SW2
NetQ19_2: Q19.2(G1) R82.1 R83.1
NetQ19_5: Q19.5(G2) Q19.6(D1) R84.2 U20.C2(OE)
NetQ20_3: Q20.3(D2) R72.2
NetQ20_6: Q20.6(D1) R71.2
NetQ22_2: Q22.2(G1) R67.2 R105.1
NetQ22_5: Q22.5(G2) Q22.6(D1)
NetQ23_5: Q23.5(G2) Q23.6(D1) R109.1
NetQ24_2: Q24.2(G1) R81.1 R107.1
NetQ24_3: Q24.3(D2) U24.9(RESET_N)
NetQ24_6: Q24.6(D1) U24.18(SAFEBOOT_N)
NetQ26_2: Q26.2(G1) R115.1 ; port NORA_EN_MAX
NetQ26_5: Q26.5(G2) Q26.6(D1) Q27.6(D1) R116.2
NetQ27_2: Q27.2(G1) R117.1 ; port SARA_EN_MAX
NetQ28_6: Q28.6(D1) R128.1 U33.4(VCTRL)
NetR18_2: R18.2 U22.D2(A1) ; port MAX_TIME_PULSE
NetR67_1: R67.1 ; port MAX_BACKUP_EN
NetR69_2: R69.2 U20.A2(B1) ; port UART3.RX3
NetR83_2: R83.2 ; port NORA_MAX_COM_EN
NetTP13_1: U19.D2(A1) ; port DDC_SDA
NetTP14_1: U19.D1(A2) ; port DDC_SCL
NetTP54_1: U22.D1(A2) ; port MAX_EXT_INT
NetU6_42: U20.A1(B2) ; port UART3.TX3
NetU24_11: U24.11(RF_IN) U33.5(IN)
NetU32_3: U32.3(OUT2) U33.1(OUT1)

Not connected (* = marked no-connect by the designer): Q27 3(D2)*; Q28 3(D2)*; U24 15(V_ANT/RSVD)*

### Layout directives
net class RF: NetA2_1, NetC98_1, NetC98_2, NetC99_1, NetC99_2, NetC103_2, NetFIL1_1, NetFIL2_4, NetL1_2, NetL2_1, NetU24_11, NetU32_3

### Notes on the sheet
- GNSS antenna
- ESD protection
- MAX module source
- (near J6) current measurement
- Place jumper to enable
- (near J1) external LNA/SAW
- B13 notch filter
- Level translate/isolate
- (near C97) I_MAX
- SAW
- (near FIL2) filter
- (near U25) LNA
- (near FIL1) filter
- DC Block
- MAX-M10S module
- LNA/SAW bypass
- 3V0 LDO regulator
- To NORA module
- (near D15) USB-UART bridge mode
- TX activity
- RX activity
- (near D21) MAX power
- To USB-UART bridge
- Level translators used as switches supporting partial power down of 3V3_SER domain (when USB not present)
- Revision:
- Page:

### Library data of the parts
?#8 = Sub_Title_Block: as ?#5 on sheet C210_0006_Power
A2 = CGGP.25.4.E.02: ANT, THROUGH-HOLE, PATCH, GNSS, BEIDOU, GLONASS, GPS, 5dBi, 25MMx35MMx4MM; Manufacturer 1: Taoglas; Body Size: 25mm x 25mm; Item Phase: Unreleased; MFG Package: Custom; Use in new designs: Yes; UBX Code: None; Part Number: CGGP.25.4.E.02; Manufacturer Part Number 1: CGGP.25.4.E.02; Supplier 1: Digi-key; Supplier Part Number 1: 931-1472-ND; Height: 4mm; Max Operating Temp: 125; Min Operating Temp: -55; Pins: 1; Revision: None; Size: Other; SMT Pitch: N/A; Voltage: N/A; Manufacturer 2: Molex; Manufacturer Part Number 2: 2042860001; Supplier 2: None; Supplier Part Number 2: None
C73-C75 C77-C81 C117 C120 = 120-00016: as C45 on sheet C210_0006_Power; Part Number: 120-00016; Revision: 0A; Supplier 1: Digi-Key; Supplier Part Number 1: 490-6297-1-ND; Manufacturer 2: Yageo; Manufacturer P/N 2: CC0402KRX5R6BB104; Supplier 2: Digi-Key; Supplier Part Number 2: 311-1336-1-ND; Arena Link: https://app.bom.com/a/GYHPV2L2L43KRMBK?v=spec.summary; Height: 0.55mm; Pins: 2; Temperature Coefficient: X5R; Voltage: 10V
C92 C93 C96 C100 C107 C122 C123 = 120-00047: as C63 on sheet C210_0006_Power; Part Number: 120-00047; Supplier 1: Digi-Key; Supplier Part Number 1: 490-8219-1-ND; Manufacturer 2: AVX Corporation; Manufacturer Part Number 2: 04025A680FAT2A; Supplier 2: Digi-Key; Supplier Part Number 2: 478-7881-1-ND; Height: 0.55mm; Max Operating Temp: 125; Min Operating Temp: -55; Pins: 2; Revision: None; Temperature Coefficient: NP0; Voltage: 50V
C97 C98 C105 C106 = 120-00010: CAP CER 1.0nF 50V 10% X7R 0402; Manufacturer 1: TDK Corporation; Manufacturer Part Number 1: C1005X7R1H102K050BE; Item Phase: In Production; Tolerance: +/- 10%; Use in new designs: Yes; UBX Code: None; Part Number: 120-00010; Supplier 1: Digi-Key; Supplier Part Number 1: 445-173622-1-ND; Manufacturer 2: Kemet; Manufacturer Part Number 2: C0402C102K5RACTU; Supplier 2: Digi-Key; Supplier Part Number 2: 399-1032-1-ND; Height: 0.55mm; Max Operating Temp: 125; Min Operating Temp: -55; Part Name: CAP CER 1.0NF 50V 10% X7R 0402; Pins: 2; Revision: 0D; Temperature Coefficient: X7R; Voltage: 50V
C99 = 120-00081: Cap, Ceramic 47pF 50V 5% NP0 0402; Manufacturer 1: Murata Electronics North America; Manufacturer Part Number 1: GRM1555C1H470JA01D; Part Name: CAP CER 47PF 50V 5% NP0 0402; Item Phase: In Production; Tolerance: +/- 5%; Use in new designs: Yes; UBX Code: None; Part Number: 120-00081; Supplier 1: Digi-Key; Supplier Part Number 1: 490-5942-1-ND; Manufacturer 2: Samsung Electro-Mechanics America, Inc; Manufacturer Part Number 2: CL05C470JB5NNNC; Supplier 2: Digi-Key; Supplier Part Number 2: 1276-1699-1-ND; Height: 0.55mm; Max Operating Temp: 125; Min Operating Temp: -55; Pins: 2; Revision: 0A; Temperature Coefficient: NP0; Voltage: 50V
C103 = 120-00079: CAP CER 3.3PF 50V +/-0.25pF NP0 0402; Manufacturer 1: Murata Electronics North America; Manufacturer Part Number 1: GRM1555C1H3R3CA01D; Item Phase: In Production; Tolerance: Other; Use in new designs: Yes; UBX Code: None; Part Number: 120-00079; Supplier 1: Digi-Key; Supplier Part Number 1: 490-5938-1-ND; Manufacturer 2: Samsung Electro-Mechanics America, Inc; Manufacturer Part Number 2: CL05C3R3CB5NNNC; Supplier 2: Digi-Key; Supplier Part Number 2: 1276-1141-1-ND; Height: 0.55mm; Max Operating Temp: 125; Min Operating Temp: -55; Part Name: CAP CER 3.3PF 50V +/-0.25pF NP0 0402; Pins: 2; Revision: 0A; Temperature Coefficient: NP0; Voltage: 50V
C104 = 120-00110: as C145 on sheet C210_0001_Serial_Interface; Part Number: 120-00110; Supplier 1: Digi-Key; Supplier Part Number 1: 490-5888-1-ND; Manufacturer 2: None; Manufacturer Part Number 2: None; Supplier 2: None; Supplier Part Number 2: None; Height: 0.55mm; Max Operating Temp: 125; Min Operating Temp: -55; Pins: 2; Revision: 0A; Voltage: 50V
C119 C121 = 120-00017: as C148 on sheet C210_0006_Power; Part Number: 120-00017; Revision: 0A; Supplier 1: Digi-Key; Supplier Part Number 1: 490-3890-1-ND; Manufacturer 2: TDK Corporation; Manufacturer P/N 2: C1005X5R1A105K050BB; Supplier 2: Digi-Key; Supplier Part Number 2: 445-4114-1-ND; Arena Link: https://app.bom.com/a/1J2AGN6N6PO5C7V9?v=spec.summary; Height: 0.55mm; Pins: 2; Temperature Coefficient: X5R; Voltage: 10V
C128 = 120-00020: as C47 on sheet C210_0006_Power; Part Number: 120-00020; Supplier 1: Digi-Key; Supplier Part Number 1: 1276-1482-1-ND; Manufacturer 2: Yageo; Manufacturer Part Number 2: CC0402KRX5R6BB475; Supplier 2: Digi-Key; Supplier Part Number 2: 311-3477-1-ND; Height: 0.55mm; Max Operating Temp: 85; Min Operating Temp: -55; Pins: 2; Revision: 0C; Temperature Coefficient: X5R; Voltage: 10V
D15 = 115-00023: LED BLUE DIFFUSED 0603 SMD; Manufacturer 1: OSRAM Opto Semiconductors Inc; Manufacturer Part Number 1: LB Q39G-L2OO-35-1; Body Size: None; Item Phase: Unreleased; Color: *; Part Number: 115-00023; Supplier 1: Digi-Key; Supplier Part Number 1: 475-2816-1-ND; Current: None; Height: None; MFG Package: None; Max Operating Temp: None; Min Operating Temp: None; Part Name: LED BLUE DIFFUSED 0603 SMD; Pins: None; Revision: None; Size: None; Use in new designs: None; Voltage: None; UBX Code: None; Manufacturer 2: None; Manufacturer Part Number 2: None; Supplier 2: None; Supplier Part Number 2: None
D16 = LTST-C190KGKT: DIODE, LED, SMT, GREEN, CLEAR LENS, 2.0V 20mA, 0603; Part Number: 115-00019; Manufacturer 1: Lite-On Inc; Part Name: LED Green SMT 0603; Body Size: 1.60mm x 0.80mm; Item Phase: In Production; MFG Package: None; Use in new designs: Yes; Manufacturer Part Number 1: LTST-C190KGKT; Supplier 1: Digi-Key; Supplier Part Number 1: 160-1435-2-ND; Current: 20mA; Height: 0.80mm; Max Operating Temp: 85; Min Operating Temp: -30; Pins: 2; Revision: 0A; Size: 0603; Voltage: 2.0V; UBX Code: None; Manufacturer 2: None; Manufacturer Part Number 2: None; Supplier 2: None; Supplier Part Number 2: None; Color: *
D17 = LTST-C190YKT: DIODE, LED, SMT, YELLOW, CLEAR LENS, 2.1V 10mA, 0603; Manufacturer 1: Lite-On Inc; Part Name: LED Yellow SMT 0603; Body Size: 1.60mm x 0.80mm; Item Phase: In Production; MFG Package: None; Use in new designs: Yes; Part Number: LTST-C190YKT; Manufacturer Part Number 1: LTST-C190YKT; Supplier 1: Digi-Key; Supplier Part Number 1: 160-1184-2-ND; Current: 10mA; Height: 0.80mm; Max Operating Temp: 85; Min Operating Temp: -30; Pins: 2; Revision: 0A; Size: 0603; Voltage: 2.1V; UBX Code: None; Manufacturer 2: None; Manufacturer Part Number 2: None; Supplier 2: None; Supplier Part Number 2: None; Color: *
D18 = ESD9101P2T5G: Diode, TVS, SMT, ESD9101P2T5G, 3.3V, 0.5pF, SOD-923; Manufacturer 1: ON Semiconductor; Part Name: Diode TVS 3.3V SOD-923; Body Size: 0.8mm x 0.6mm; Current: None; Item Phase: In Production; Use in new designs: Yes; Manufacturer Part Number 1: ESD9101P2T5G; Height: 0.4mm; MFG Package: SOD-923; Max Operating Temp: 150; Min Operating Temp: -55; Pins: 2; Revision: 0A; Voltage: 3.3V; UBX Code: None
D21 = LTST-C190EKT: DIODE, LED, SMT, Red, CLEAR LENS, 2.0V 10mA, 0603; Manufacturer 1: Lite-On Inc; Part Name: LED Red SMT 0603; Body Size: 1.60mm x 0.80mm; Item Phase: In Production; MFG Package: None; Use in new designs: Yes; Part Number: LTST-C190EKT; Manufacturer Part Number 1: LTST-C190EKT; Supplier 1: Digi-Key; Supplier Part Number 1: 160-1182-2-ND; Current: 10mA; Height: 0.80mm; Max Operating Temp: 85; Min Operating Temp: -30; Pins: 2; Revision: 0A; Size: 0603; Voltage: 2.0V; UBX Code: None; Manufacturer 2: None; Manufacturer Part Number 2: None; Supplier 2: None; Supplier Part Number 2: None; Color: *
FB3-FB8 = 155-00003: Ferrite Bead, 1k Ohm @ 100MHz, 0402; Manufacturer 1: Taiyo Yuden; Manufacturer Part Number 1: BK1005HM102-T; Part Name: FERRITE BEAD 1K OHM 0402; Body Size: None; Current: 150mA; Item Phase: In Production; Use in new designs: Yes; Value: None; Part Number: 155-00003; Supplier 1: Digi-Key; Supplier Part Number 1: 587-1835-1-ND; Height: 0.55mm; MFG Package: None; Max Operating Temp: 125; Min Operating Temp: -55; Pins: 2; Revision: 0A; Voltage: None; Manufacturer 2: Kemet; Manufacturer Part Number 2: Z0402C102BSMST; Supplier 2: Digi-Key; Supplier Part Number 2: 399-9602-1-ND; UBX Code: None
FIL1 FIL2 = B39162B4353P810: FILTER, SMT, SAW, GNSS, 1.559-1.606GHz, LGA5; Manufacturer 1: RF360; Body Size: 1.4mm x 1.1mm; Current: None; Item Phase: In Production; Use in new designs: Yes; Part Number: B39162B4353P810; Manufacturer Part Number 1: B39162B4353P810; Supplier 1: Mouser; Supplier Part Number 1: 871-B39162B4353P810; Height: 0.45mm; MFG Package: QCS5P; Max Operating Temp: 85; Min Operating Temp: -40; Part Name: B39162B4353P810; Pins: 5; Revision: 0A; Voltage: N/A; UBX Code: None
J1 = 10129380-902001ALF: Header, 0.100" Pitch, 2 Pin, Vertical SMT, Black; Manufacturer 1: Amphenol ICC (FCI); Part Name: CON HDR 0.1" 2 Pin 1 Row SMT; Item Phase: In Production; Use in new designs: Yes; Voltage: None; Part Number: 10129380-902001ALF; Manufacturer Part Number 1: 10129380-902001ALF; Diameter: None; Height: 9.93mm; Max Operating Temp: None; Min Operating Temp: None; Pins: 2; Revision: 0C; UBX Code: None; Manufacturer 2: Sullins Connector Solutions; Manufacturer Part Number 2: NREC002SABC-M30RC; Manufacturer P/N: *
J6 = 130-00105: as J10 on sheet C210_0006_Power; Manufacturer P/N: *; Part Number: 130-00105; Supplier 1: Digi-Key; Supplier Part Number 1: 952-1951-ND; Diameter: None; Height: 9.93mm; Max Operating Temp: None; Min Operating Temp: None; Pins: 3; Revision: 0C; UBX Code: None; Manufacturer 2: Greenconn Corporation; Manufacturer Part Number 2: GPHC1010302A081B1BD; Supplier 2: Teamwise Limited; Supplier Part Number 2: Greenconn Corporation GPHC1010302A081B1BD
L1 = 150-00028: Inductor, 12nH, 300mA, 0402; Manufacturer 1: Johanson Technology Inc.; Manufacturer Part Number 1: L-07C12NJV6T; Part Name: IND 12nH 250mA 0402; Body Size: None; Item Phase: Unreleased; Tolerance: +/- 5%; Use in new designs: Yes; Part Number: 150-00028; Supplier 1: Digi-Key; Supplier Part Number 1: 712-1453-1-ND; Current: 300mA; Height: 0.6mm; Isat: None; Max Operating Temp: 125; Min Operating Temp: -55; Pins: 2; Revision: None; Voltage: N/A; UBX Code: None; Manufacturer 2: None; Manufacturer Part Number 2: None; Supplier 2: None; Supplier Part Number 2: None
L2 L3 = 150-00010: INDUCTOR 10NH 300MA 0402; Manufacturer 1: Murata Electronics North America; Manufacturer Part Number 1: LQG15HS10NJ02D; Body Size: None; Item Phase: In Production; Tolerance: +/- 5%; Use in new designs: Yes; Part Number: 150-00010; Supplier 1: Digi-Key; Supplier Part Number 1: 490-2623-1-ND; Current: None; Height: 0.55mm; Isat: 300mA; Max Operating Temp: 125; Min Operating Temp: -55; Part Name: INDUCTOR 10NH 300MA 0402; Pins: 2; Revision: 0A; Voltage: None; UBX Code: None; Manufacturer 2: None; Manufacturer Part Number 2: None; Supplier 2: None; Supplier Part Number 2: None
NC10 NC13 NC14 = Solderbridge-Short: Added By: Paul B; Part Number: Solderbridge-Short; Height: 0; DNP: DNP; Added Date: 12/2/2015
NO2 = Solderbridge-Open: Added By: Paul B; Part Number: Solderbridge-Open; Height: 0; DNP: DNP; Added Date: 12/2/2015
Q19 Q24 = 140-00016: as Q14 on sheet C210_0001_Serial_Interface; Part Number: 140-00016; Supplier 1: Digi-Key; Supplier Part Number 1: SSM6N56FELMCT-ND; Height: 0.6mm; MFG Package: SOT-563; Max Operating Temp: 150; Min Operating Temp: -55; Pins: 6; Revision: 0A; Voltage: 20V; Manufacturer 2: None; Manufacturer Part Number 2: None; Supplier 2: None; Supplier Part Number 2: None
Q20 = FDY2000PZ: MOSFET DUAL P-CH 20V SOT-563, -350mA; Manufacturer 1: ON Semiconductor; Body Size: 1.6mmx1.6mm; Item Phase: In Production; Transistor Type: Multiple; Thermal Pad: No; Use in new designs: Yes; UBX Code: None; Part Number: FDY2000PZ; Manufacturer Part Number 1: FDY2000PZ; Supplier 1: Digi-Key; Supplier Part Number 1: 2156-FDY2000PZ-ND; Current: -350mA; Height: 0.6mm; MFG Package: SOT-563; Max Operating Temp: 150; Min Operating Temp: -55; Part Name: MOSFET DUAL P-CH 20V SOT-563; Pins: 6; Revision: 0A; Voltage: 20V; Manufacturer 2: Diodes, Inc.; Manufacturer Part Number 2: DMP2004VK-7; Supplier 2: None; Supplier Part Number 2: None
Q22 Q23 Q26-Q28 = 140-00030: MOSFET N/P-CH 20V SOT-563, 540 mA, −430 mA; Manufacturer 1: ON Semiconductor; Manufacturer Part Number 1: NTZD3155CT2G; Body Size: 1.6mmx1.6mm; Transistor Type: Multiple; Use in new designs: Yes; Item Phase: In Production; Thermal Pad: No; UBX Code: None; Part Number: 140-00030; Part Name: MOSFET N/P-CH 20V SOT-563; Supplier 1: Digi-Key; Supplier Part Number 1: NTZD3155CT2GOSCT-ND; Current: 540 mA, −430 mA; Height: 0.6mm; MFG Package: SOT-563; Pins: 6; Voltage: 20V; Max Operating Temp: 150; Min Operating Temp: -55; Revision: 0A; Manufacturer 2: None; Manufacturer Part Number 2: None; Supplier 2: None; Supplier Part Number 2: None
R18 R69 R78 R86 R107 = 180-00093: as R50 on sheet C210_0006_Power; Part Number: 180-00093; Supplier 1: Digi-Key; Supplier Part Number 1: 311-100KLRCT-ND; Manufacturer 2: Rohm Semiconductor; Manufacturer Part Number 2: MCR01MRTF1003; Supplier 2: Digi-Key; Supplier Part Number 2: RHM100KCDCT-ND; Height: 0.4mm; Max Operating Temp: 155; Min Operating Temp: -55; Pins: 2; Power: 1/16W; Revision: 0B; UBX Code: None
R67 = 180-00024: as R36 on sheet C210_0006_Power; Part Number: 180-00024; Supplier 1: Digi-Key; Supplier Part Number 1: 1276-3431-1-ND; Manufacturer 2: Hong Kong Resistors Manufactory; Manufacturer Part Number 2: RCT0210KFLF; Supplier 2: None; Supplier Part Number 2: None; Height: 0.4mm; Max Operating Temp: 155; Min Operating Temp: -55; Pins: 2; Power: 1/16W; Revision: 0E; Voltage: N/A
R68 = 180-00031: as R124 on sheet C210_0006_Power; Part Number: 180-00031; Part_Type: Resistor; Supplier 1: Digi-Key; Supplier Part Number 1: RHM499CDCT-ND; Manufacturer 2: Samsung Electro-Mechanics America, Inc; Manufacturer P/N 2: RC1005F4990CS; Arena Link: https://app.bom.com/a/Q8RZ5CVCVEDU1SS5?v=spec.summary; Height: 0.4mm; Pins: 2; Power: 1/16W; Revision: 0D; Supplier 2: Digi-Key; Supplier Part Number 2: 1276-3992-1-ND; Alternate Footprint Ref: RES 0402
R70 R82 R84 R85 R105 R108 R109 R113 R115-R117 R128 R129 = 180-00054: as R43 on sheet C210_0006_Power; Part Number: 180-00054; Supplier 1: Digi-Key; Supplier Part Number 1: 1276-3433-1-ND; Manufacturer 2: Hong Kong Resistors Manufactory; Manufacturer Part Number 2: RCT021MFLF; Supplier 2: None; Supplier Part Number 2: None; Height: 0.4mm; Max Operating Temp: 155; Min Operating Temp: -55; Pins: 2; Power: 1/16W; Revision: 0D; UBX Code: None
R71 R118 = 180-00098: as R126 on sheet C210_0006_Power; Part Number: 180-00098; Part_Type: Resistor; Supplier 1: Digi-Key; Supplier Part Number 1: P220JCT-ND; Arena Link: https://app.bom.com/a/8Q9HNUDUDWVBJC30?v=spec.summary; Pins: 2; Power: 1/16W; Revision: 0C; Manufacturer 2: Samsung Electro-Mechanics America, Inc; Manufacturer P/N 2: RC1005J221CS; Supplier 2: Digi-Key; Supplier Part Number 2: 1276-4360-1-ND; Alternate Footprint Ref: RES 0402; Height: 0.4mm
R72 = 180-00051: as R6 on sheet C210_0006_Power; Part Number: 180-00051; Supplier 1: None; Supplier Part Number 1: None; Manufacturer 2: Stackpole Electronics Inc.; Manufacturer Part Number 2: RMCF0402FT100R; Supplier 2: Digi-Key; Supplier Part Number 2: RMCF0402FT100RCT-ND; Height: 0.4mm; Max Operating Temp: 155; Min Operating Temp: -55; Pins: 2; Power: 1/16W; Revision: 0E; UBX Code: None
R81 R83 R96 = 180-00021: as R54 on sheet C210_0006_Power; Part Number: 180-00021; Supplier 1: None; Supplier Part Number 1: None; Manufacturer 2: Yageo; Manufacturer Part Number 2: RC0402FR-071KL; Supplier 2: Digi-Key; Supplier Part Number 2: 311-1.00KLRCT-ND; Height: 0.4mm; Max Operating Temp: 155; Min Operating Temp: -55; Pins: 2; Power: 1/16W; Revision: 0E; UBX Code: None
SWC1 = MS-156C3: Conn, Coax, Test, Switch, 50Ohm, SMT, 2.5mmX2.4mm; Manufacturer 1: Hirose; Part Name: CON HDR 0.1" 3 Pin 1 Row SMT R/A; Item Phase: In Production; Use in new designs: Yes; Voltage: None; Part Number: MS-156C3; Manufacturer Part Number 1: MS-156C3; Supplier 1: None; Supplier Part Number 1: None; Diameter: None; Height: 3.05mm; Max Operating Temp: None; Min Operating Temp: None; Pins: 3; Revision: 0A; UBX Code: None; Manufacturer 2: None; Manufacturer Part Number 2: None; Supplier 2: None; Supplier Part Number 2: None; Manufacturer P/N: *
TP33 TP35 TP37 TP39 TP42 = TP_R: as TP28-TP31 on sheet C210_0006_Power; Size: 1.0mm; Height: 0; DNP: DNP; Added Date: 2/1/2015; Checked By: Paul B; Checked Date: 2/5/2015
U19-U22 = TXS0102YZP: IC, SMT, LEVEL TRANSLATOR, DUAL, BIDIRECTIONAL, DSBGA-8 1.9mmX0.9mm; Manufacturer 1: Texas Instruments; Manufacturer Part Number 1: TXS0102YZPT; Current: None; Item Phase: In Production; Use in new designs: Yes; Part Number: TXS0102YZP; Manufacturer 2: Texas Instruments; Manufacturer Part Number 2: TXS0102YZPR; Body Size: 1.9mm x 0.9mm; Height: 0.65mm; MFG Package: DSBGA-8; Max Operating Temp: 85; Min Operating Temp: -40; Part Name: TXS0102YZP; Pins: 8; Revision: 0A; Voltage: N/A; UBX Code: None
U24 = MAX: u-blox MAX GNSS module; Part Description: u-blox GNSS module; Manufacturer Part Number 1: MAX-M10S-00B-00; Manufacturer: u-blox; Value: MAX-M10S; Manufacturer 1: u-blox
U25 = BGA123L4: LNA, SMT, GNSS, 1.1-3.6V, 1.1mA18dB, 0.75dB, BGA4; Manufacturer 1: Infineon Technologies; Manufacturer Part Number 1: BGA123L4E6327XTSA1; Body Size: 0.7mm x 0.7mm; Current: None; Item Phase: In Production; MFG Package: TSLP-4-11; Use in new designs: Yes; Part Number: BGA123L4; Supplier 1: Digi-Key; Supplier Part Number 1: BGA123L4E6327XTSA1TR-ND; Height: 0.35mm; Max Operating Temp: 85; Min Operating Temp: -40; Part Name: BGA123L4; Pins: 4; Revision: 0A; Voltage: 1.1-3.6V; UBX Code: None
U29 = 260-00027: LDO, 3.0V, 200mA, SOT-5; Manufacturer 1: Toshiba Semiconductor and Storage; Manufacturer Part Number 1: TCR2LE30,LM(CT; Part Name: TCR2LE30; Body Size: 2.9mm x 1.6mm; Item Phase: Unreleased; Reg Outputs: 1xLDO; SMT Pitch: None; Thermal Pad: No; Use in new designs: Yes; Voltage: 6.0V; Manufacturer P/N: *; Part Number: 260-00027; Supplier 1: Digi-Key; Supplier Part Number 1: TCR2LE30LM(CTCT-ND; Current: 200mA; Height: 1.3mm; MFG Package: SOT-553; Max Operating Temp: 85; Min Operating Temp: -40; Pins: 5; Revision: None; UBX Code: None; Manufacturer 2: None; Manufacturer Part Number 2: None; Supplier 2: None; Supplier Part Number 2: None
U32 U33 = SKY13585-679LF:: RF SWITCH, SPDT, I2C, 3-AXIS, 3-5V, 1-6GHz, SMT, DFN-6, 1mmX1mm; Manufacturer 1: ST Micro; Part Name: LIS3MDL; Body Size: 2mm x 2mm; Current: None; Item Phase: In Production; MFG Package: LGA-12; Use in new designs: Yes; Voltage: 1.9-3.6V; Part Number: SKY13585-679LF:; Manufacturer Part Number 1: SKY13585-679LF:; Height: 1mm; Max Operating Temp: 85; Min Operating Temp: -40; Pins: 12; Revision: 0A; UBX Code: None